# Altium schematic sheet Control_Panel_Power.SchDoc: Наименование
size 420 x 297 mm; ApprovedBy: Сидоров; CheckedBy: Петров; Author: Иванов; CompanyName: РГППУ; Title2str: Изделия; DecimalNumber: АБВГ.123456.001 33
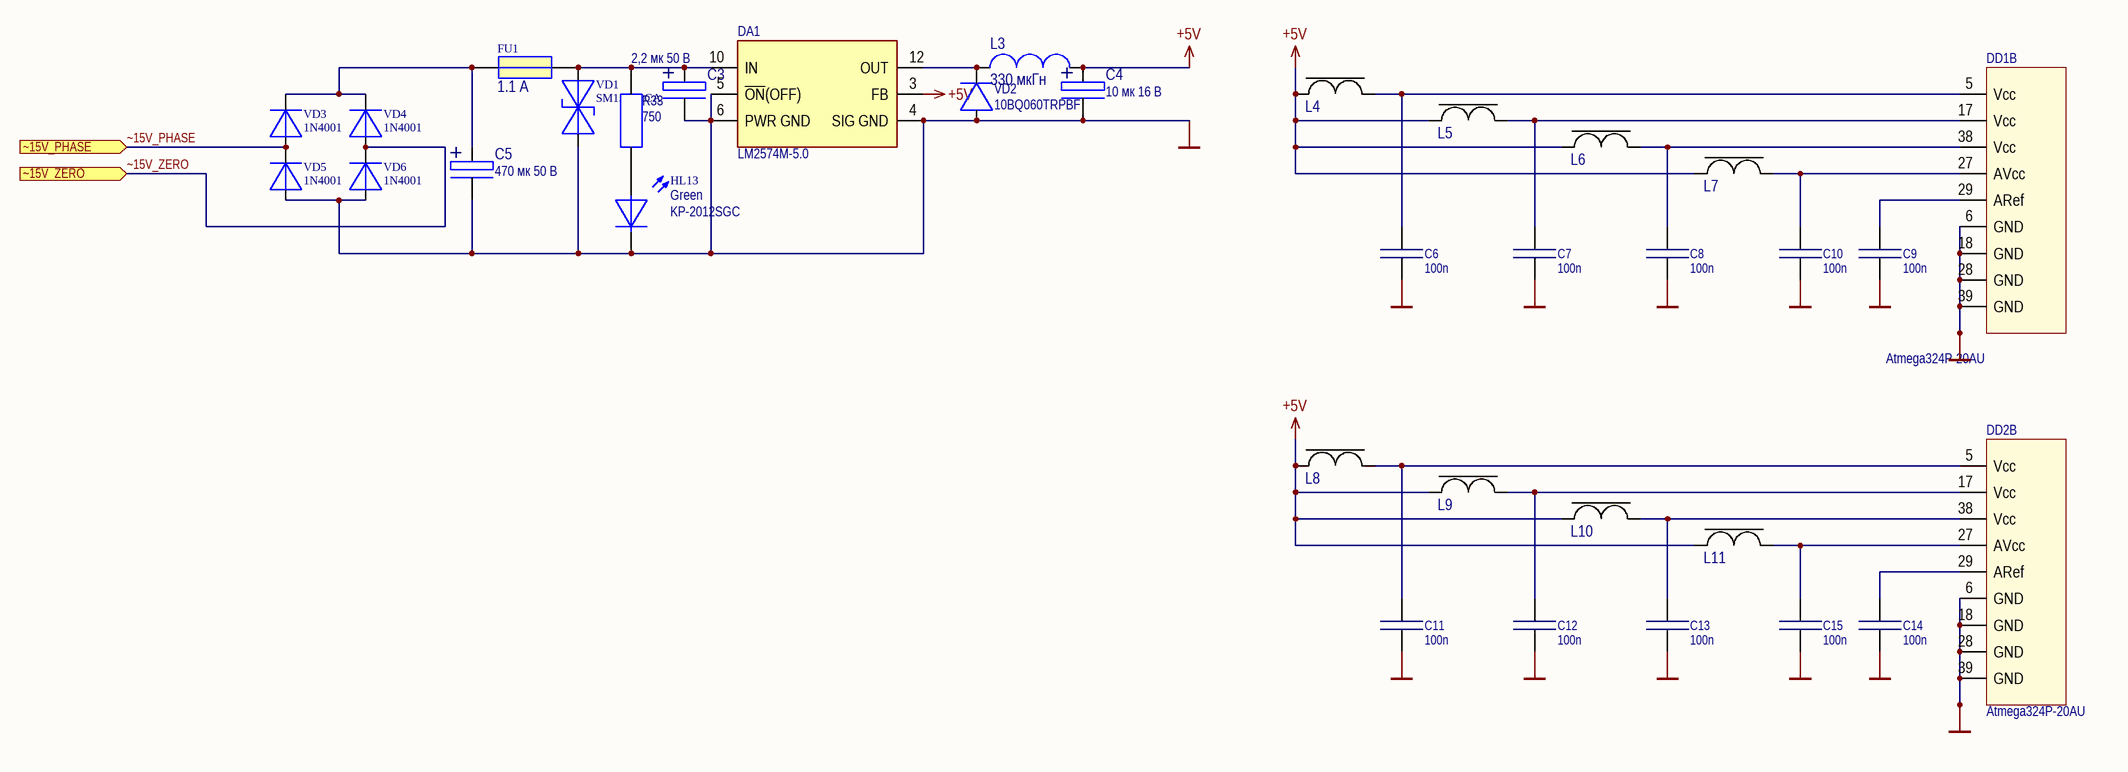
[diagram p0: Control_Panel_Power.SchDoc]

## Parts
C3  value 2,2 мк 50 В  [CAP_POLAR_ELLYTE_B]  (hidden comment: CA050M2R20REB-0405)
C4  value 10 мк 16 В  [CAP_POLAR_ELLYTE_B]  (hidden comment: CA016M0010REB-0405)
C5  value 470 мк 50 В  [CAP_POLAR_10mm]  (hidden comment: CA035M0220REG)
C6  100n  [SMDRC0805]
C7  100n  [SMDRC0805]
C8  100n  [SMDRC0805]
C9  100n  [SMDRC0805]
C10  100n  [SMDRC0805]
C11  100n  [SMDRC0805]
C12  100n  [SMDRC0805]
C13  100n  [SMDRC0805]
C14  100n  [SMDRC0805]
C15  100n  [SMDRC0805]
DA1  LM2574M-5.0  [SOIC127P1030X264-14M]
DD1  Atmega324P-20AU  [44ML_M]  (part B of 2)
DD2  Atmega324P-20AU  [44ML_M]  (part B of 2)
FU1  value 1.1 А  [EFuse 1.1A]  (hidden comment: EFuse LP60-110F)
HL13  Green  ManufacturerPartNumber: KP-2012SGC  [DIOMELF2012M]
L3  value 330 мкГн  [INDP7972X50M]  (hidden comment: SCD0705T-331K-N)
L4  MPZ1608S181A  [INDC0603X03M]  (value not drawn)
L5  MPZ1608S181A  [INDC0603X03M]  (value not drawn)
L6  MPZ1608S181A  [INDC0603X03M]  (value not drawn)
L7  MPZ1608S181A  [INDC0603X03M]  (value not drawn)
L8  MPZ1608S181A  [INDC0603X03M]  (value not drawn)
L9  MPZ1608S181A  [INDC0603X03M]  (value not drawn)
L10  MPZ1608S181A  [INDC0603X03M]  (value not drawn)
L11  MPZ1608S181A  [INDC0603X03M]  (value not drawn)
R33  750  [SMDRC0805]
VD1  SM15T12CA  [SUPRES3216X18N]
VD2  10BQ060TRPBF  [SHOTKY 4.1x3.3]
VD3  1N4001  [PinDiode]
VD4  1N4001  [PinDiode]
VD5  1N4001  [PinDiode]
VD6  1N4001  [PinDiode]

## Ports
~15V_PHASE, ~15V_ZERO

## Nets
+5V: C4.2(+) DA1.3(FB) L3.1 L4.1 L5.1 L6.1 L7.1 L8.1 L9.1 L10.1 L11.1
GND: C3.1(-) C4.1(-) C5.1(-) C6.2 C7.2 C8.2 C9.2 C10.1 C11.2 C12.2 C13.2 C14.2 C15.1 DA1.4(SIG_GND) DA1.5(~{ON}(OFF)) DA1.6(PWR_GND) DD1.6(GND) DD1.18(GND) DD1.28(GND) DD1.39(GND) DD2.6(GND) DD2.18(GND) DD2.28(GND) DD2.39(GND) HL13.2 VD1.1 VD2.A VD5.A VD6.A
~15V_PHASE: VD3.A VD5.K ; port ~15V_PHASE
~15V_ZERO: VD4.A VD6.K ; port ~15V_ZERO
NetC3_2: C3.2(+) DA1.10(IN) FU1.2 R33.2 VD1.2
NetC5_2: C5.2(+) FU1.1 VD3.K VD4.K
NetC6_1: C6.1 DD1.5(Vcc) L4.2
NetC7_1: C7.1 DD1.17(Vcc) L5.2
NetC8_1: C8.1 DD1.38(Vcc) L6.2
NetC9_1: C9.1 DD1.29(ARef)
NetC10_2: C10.2 DD1.27(AVcc) L7.2
NetC11_1: C11.1 DD2.5(Vcc) L8.2
NetC12_1: C12.1 DD2.17(Vcc) L9.2
NetC13_1: C13.1 DD2.38(Vcc) L10.2
NetC14_1: C14.1 DD2.29(ARef)
NetC15_2: C15.2 DD2.27(AVcc) L11.2
NetDA1_12: DA1.12(OUT) L3.2 VD2.K
NetHL13_1: HL13.1 R33.1

## Notes on the sheet
- Изм.
- Лист
- N*докум.
- Подп.
- Дата
- Лит.
- Масса
- Масштаб
- Разраб.
- Пров.
- Т.контр.
- Лиcт
- Лиcтов
- Н.контр.
- Утв.

## Library data of the parts
C3 = 02200_050: 2,2uF 50V Polar capacitor; Manufacturer: Yageo; ManufacturerPartNumber: CA050M2R20REB-0405; Supplier: Промэлектроника; Cost: 4,11; Package: not standard; ComponentLink1Description: Datasheet; ComponentLink1URL: http://www.yageo.com/documents/recent/E-Cap_SurfaceMount_CA_2011.pdf; ComponentLink2Description: Datasheet-local; ComponentLink2URL: *
C4 = 10000_016: 10uF 16V Polar SMD cap; Manufacturer: YAGEO; ManufacturerPartNumber: CA016M0010REB-0405; Supplier: -; Cost: 3,03; Package: штырьевой; ComponentLink1Description: Datasheet; ComponentLink2Description: Datasheet-local
C5 = 470000_050: 470uF 50V Polar capacitor; Manufacturer: Yageo; ManufacturerPartNumber: CA035M0220REG; Supplier: Промэлектроника; Cost: 20,14; Package: not standard; ComponentLink1Description: Datasheet; ComponentLink1URL: http://www.promelec.ru/pdf/CA_2011.pdf; ComponentLink2Description: Datasheet-local; ComponentLink2URL: *
C6-C15 = Capacitor 0805 100n: Generic capasitor non-polar; PartNumber: Capacitor 0805 100n; Value: 100n; ComponentLink1Description: Datasheet; Package: 0805
DD1 DD2 = Atmega324P-20AU: Microcontroller 8-bit; Manufacturer: Atmel; ComponentLink1URL: http://www.atmel.com/Images/Atmel-8011-8-bit-AVR-Microcontroller-ATmega164P-324P-644P_datasheet.pdf; ComponentLink1Description: Datasheet; Cost: 220; Package: TQFP-44; Supplier: Промэлектроника; ManufacturerPartNumber: Atmega324P-20AU
FU1 = EFuse LP60-110F: Fuse; ManufacturerPartNumber: EFuse LP60-110F; ComponentLink1Description: Datasheet; ComponentLink2Description: Datasheet-local; ComponentLink2URL: *
HL13 = LED1_G: Diod LED SMD Green; ComponentLink1Description: Datasheet; Cost: 2,88; ComponentLink2Description: Datasheet-local; ComponentLink2URL: *; Color: Green
L3 = SCD0705T-331K-N: Inductor; ManufacturerPartNumber: SCD0705T-331K-N; ComponentLink1Description: Datasheet; ComponentLink1URL: http://download.siliconexpert.com/pdfs/2010/12/8/6/47/4/732/yageo_/manual/inductors_smdpower_scd_2010.pdf; ComponentLink2Description: Datasheet-local; ComponentLink2URL: *
L4-L11 = Ferrite Bead: Value: ? мГн; ManufacturerPartNumber: MPZ1608S181A; ComponentLink1Description: Datasheet; Supplier: Промэлектроника; ComponentLink2Description: Datasheet-local; ComponentLink2URL: *
R33 = Resistor 0805 750: Generic resistor; PartNumber: Resistor 0805 750; Value: 750; ComponentLink1URL: http://www.mouser.com/ds/2/447/PYu-RC0402_51_RoHS_L_6_r-8721.pdf; ComponentLink1Description: Datasheet; Package: 0805
VD1 = SM15T12CA: Diod suppressor; Manufacturer: ST Microelectronics; Notes: 12 В; ComponentLink1Description: Datasheet; ComponentLink1URL: http://www.st.com/st-web-ui/static/active/en/resource/technical/document/datasheet/CD00000724.pdf; Cost: 16,73; Package: SMC/DO-214AB; Supplier: Промэлектроника; ComponentLink2Description: Datasheet-local; ComponentLink2URL: *; ManufacturerPartNumber: SM15T12CA
VD2 = 10BQ060TRPBF: DIODE SCHOTTKY 60V 1A DO214AA; Manufacturer: Vishay Semiconductor Diodes Division; Voltage - Forward (Vf) (Max) @ If: 600mV @ 1A; Current - Reverse Leakage @ Vr: 100µA @ 60V; Category: Discrete Semiconductor Products; Diode Type: Schottky; Voltage - DC Reverse (Vr) (Max): 60V; Current - Average Rectified (Io): 1A; Reverse Recovery Time (trr): -; Mounting Type: Surface Mount; Package / Case: DO-214AA, SMB; Operating Temperature - Junction: -55°C ~ 150°C; ComponentLink1URL: http://www.vishay.com/docs/94113/vs-10bq060pbf.pdf; ComponentLink1Description: http://www.vishay.com/docs/94113/vs-10bq060pbf.pdf; ManufacturerPartNumber: 10BQ060TRPBF
VD3-VD6 = 1N4001: Rectifying diode; ComponentLink1Description: Datasheet; ComponentLink1URL: http://www.promelec.ru/pdf/1N400x.pdf; Cost: 5; Package: штырьевой; ComponentLink2Description: Datasheet-local; ComponentLink2URL: *; ManufacturerPartNumber: 1N4001
DA1 = LM2574M-5.0: ManufacturerPartNumber: LM2574M-5.0